# EAGLE design Boost (EAGLE 9.4.2)
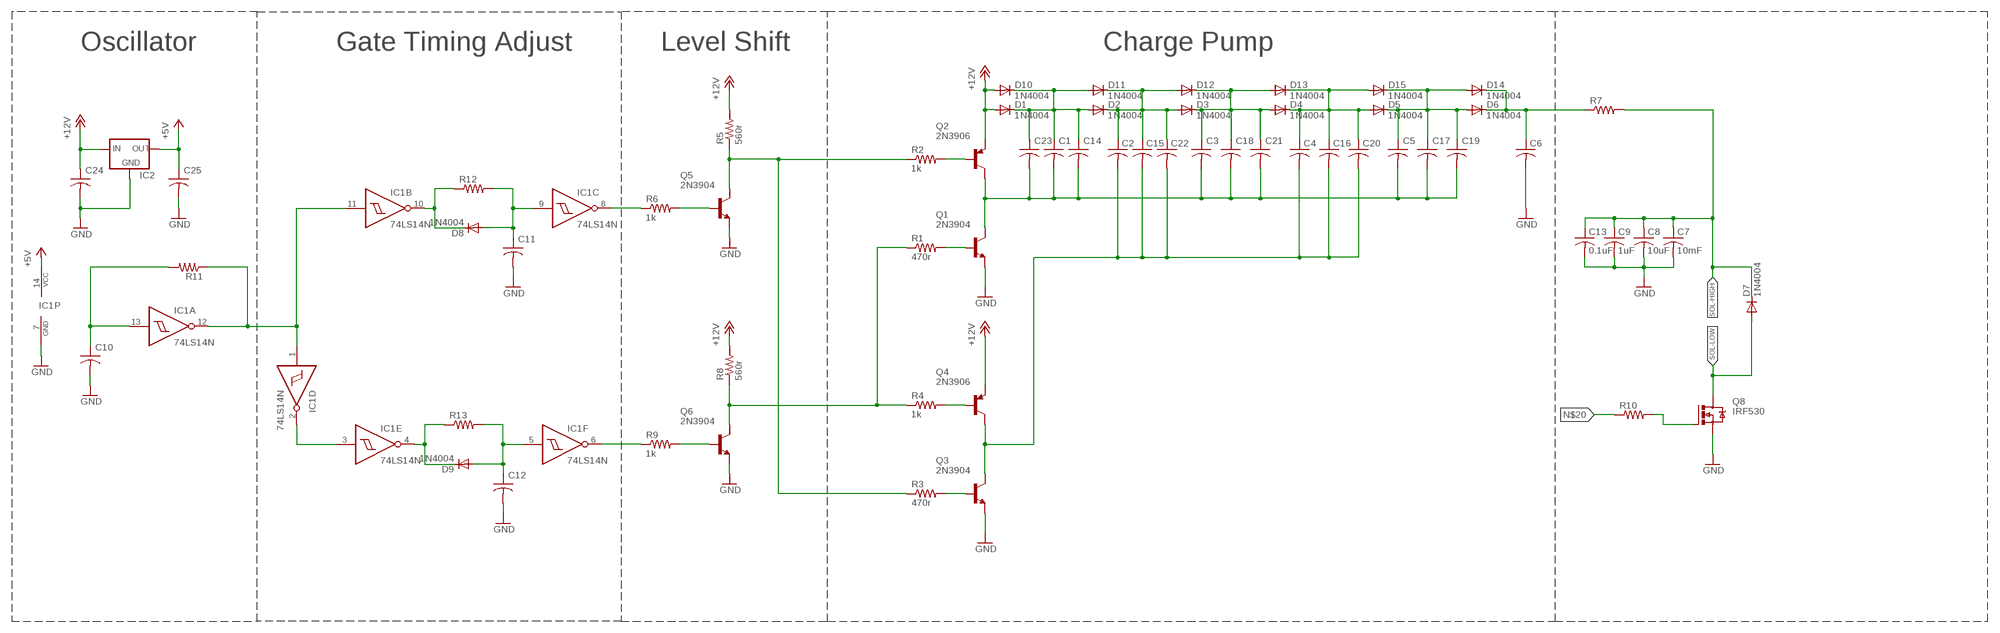
[diagram p0: schematic, sheet 1]

## Parts
C1  C-US050-024X044  [C050-024X044]
C2  C-US050-024X044  [C050-024X044]
C3  C-US050-024X044  [C050-024X044]
C4  C-US050-024X044  [C050-024X044]
C5  C-US050-024X044  [C050-024X044]
C6  C-US050-024X044  [C050-024X044]
C7  10mF  C-US050-024X044  [C050-024X044]
C8  10uF  C-US050-024X044  [C050-024X044]
C9  1uF  C-US050-024X044  [C050-024X044]
C10  C-US050-024X044  [C050-024X044]
C11  C-US050-024X044  [C050-024X044]
C12  C-US050-024X044  [C050-024X044]
C13  0.1uF  C-US050-024X044  [C050-024X044]
C14  C-US050-024X044  [C050-024X044]
C15  C-US050-024X044  [C050-024X044]
C16  C-US050-024X044  [C050-024X044]
C17  C-US050-024X044  [C050-024X044]
C18  C-US050-024X044  [C050-024X044]
C19  C-US050-024X044  [C050-024X044]
C20  C-US050-024X044  [C050-024X044]
C21  C-US050-024X044  [C050-024X044]
C22  C-US050-024X044  [C050-024X044]
C23  C-US050-024X044  [C050-024X044]
C24  C-US050-024X044  [C050-024X044]
C25  C-US050-024X044  [C050-024X044]
D1  1N4004  [DO41-10]
D2  1N4004  [DO41-10]
D3  1N4004  [DO41-10]
D4  1N4004  [DO41-10]
D5  1N4004  [DO41-10]
D6  1N4004  [DO41-10]
D7  1N4004  [DO41-10]
D8  1N4004  [DO41-10]
D9  1N4004  [DO41-10]
D10  1N4004  [DO41-10]
D11  1N4004  [DO41-10]
D12  1N4004  [DO41-10]
D13  1N4004  [DO41-10]
D14  1N4004  [DO41-10]
D15  1N4004  [DO41-10]
IC1  74LS14N  [DIL14]
IC2  78XXS  [78XXS]
Q1  2N3904  [TO92]
Q2  2N3906  [TO92]
Q3  2N3904  [TO92]
Q4  2N3906  [TO92]
Q5  2N3904  [TO92]
Q6  2N3904  [TO92]
Q8  IRF530  [TO220BV]
R1  470r  R-US_0207/10  [0207/10]
R2  1k  R-US_0207/10  [0207/10]
R3  470r  R-US_0207/10  [0207/10]
R4  1k  R-US_0207/10  [0207/10]
R5  560r  R-US_0207/10  [0207/10]
R6  1k  R-US_0207/10  [0207/10]
R7  R-US_0207/10  [0207/10]
R8  560r  R-US_0207/10  [0207/10]
R9  1k  R-US_0207/10  [0207/10]
R10  R-US_0207/10  [0207/10]
R11  R-US_0207/10  [0207/10]
R12  R-US_0207/10  [0207/10]
R13  R-US_0207/10  [0207/10]

## Nets
+5V: C25.1 IC1.14(P:VCC) IC2.OUT
+5V1: C2.1 C15.1 C22.1 D2.C D3.A D11.C D12.A
+12V: C24.1 D1.A D10.A IC2.IN Q2.3(E) Q4.3(E) R5.2 R8.2
GND: C6.2 C7.2 C8.2 C9.2 C10.2 C11.2 C12.2 C13.2 C24.2 C25.2 IC1.7(P:GND) IC2.GND Q1.3(E) Q3.3(E) Q5.3(E) Q6.3(E) Q8.S
N$1: Q5.1(C) R2.1 R3.1 R5.1
N$2: C1.1 C14.1 C23.1 D1.C D2.A D10.C D11.A
N$3: Q6.1(C) R1.1 R4.1 R8.1
N$4: Q1.2(B) R1.2
N$5: Q2.2(B) R2.2
N$6: Q5.2(B) R6.2
N$8: C3.1 C18.1 C21.1 D3.C D4.A D12.C D13.A
N$9: C4.1 C16.1 C20.1 D4.C D5.A D13.C D15.A
N$11: C5.1 C17.1 C19.1 D5.C D6.A D14.A D15.C
N$12: C6.1 D6.C D14.C R7.1
N$13: C1.2 C3.2 C5.2 C14.2 C17.2 C18.2 C19.2 C21.2 C23.2 Q1.1(C) Q2.1(C)
N$14: Q3.2(B) R3.2
N$15: Q4.2(B) R4.2
N$16: IC1.8(C:O) R6.1
N$17: Q6.2(B) R9.2
N$18: IC1.6(F:O) R9.1
N$19: Q8.G R10.2
N$20: R10.1
N$21: IC1.1(D:I) IC1.11(B:I) IC1.12(A:O) R11.1
N$22: C10.1 IC1.13(A:I) R11.2
N$23: C11.1 D8.A IC1.9(C:I) R12.2
N$24: D8.C IC1.10(B:O) R12.1
N$25: C12.1 D9.A IC1.5(F:I) R13.2
N$26: D9.C IC1.4(E:O) R13.1
N$27: IC1.2(D:O) IC1.3(E:I)
N$30: C2.2 C4.2 C15.2 C16.2 C20.2 C22.2 Q3.1(C) Q4.1(C)
SOL-HIGH: C7.1 C8.1 C9.1 C13.1 D7.C R7.2
SOL-LOW: D7.A Q8.D

## Notes on the sheet
- Oscillator | Gate Timing Adjust | Level Shift | Charge Pump

## Library data of the parts
C1-C25 = rcl:C-US: CAPACITOR, American symbol; SPICEPREFIX: C
D1-D15 = diode:1N4004: DIODE general purpose rectifier, 1 A
IC1 = 74xx-us:74*14: Hex schmitt trigger INVERTER
IC2 = v-reg:78XXS: VOLTAGE REGULATOR
Q1 Q3 Q5 Q6 = transistor-npn:2N3904: NPN Transistor
Q2 Q4 = transistor-pnp:2N3906: PNP Transistor
Q8 = transistor-power:IRF530: HEXFET Power MOSFET
R1-R13 = rcl:R-US_: RESISTOR, American symbol; SPICEPREFIX: R

## Board
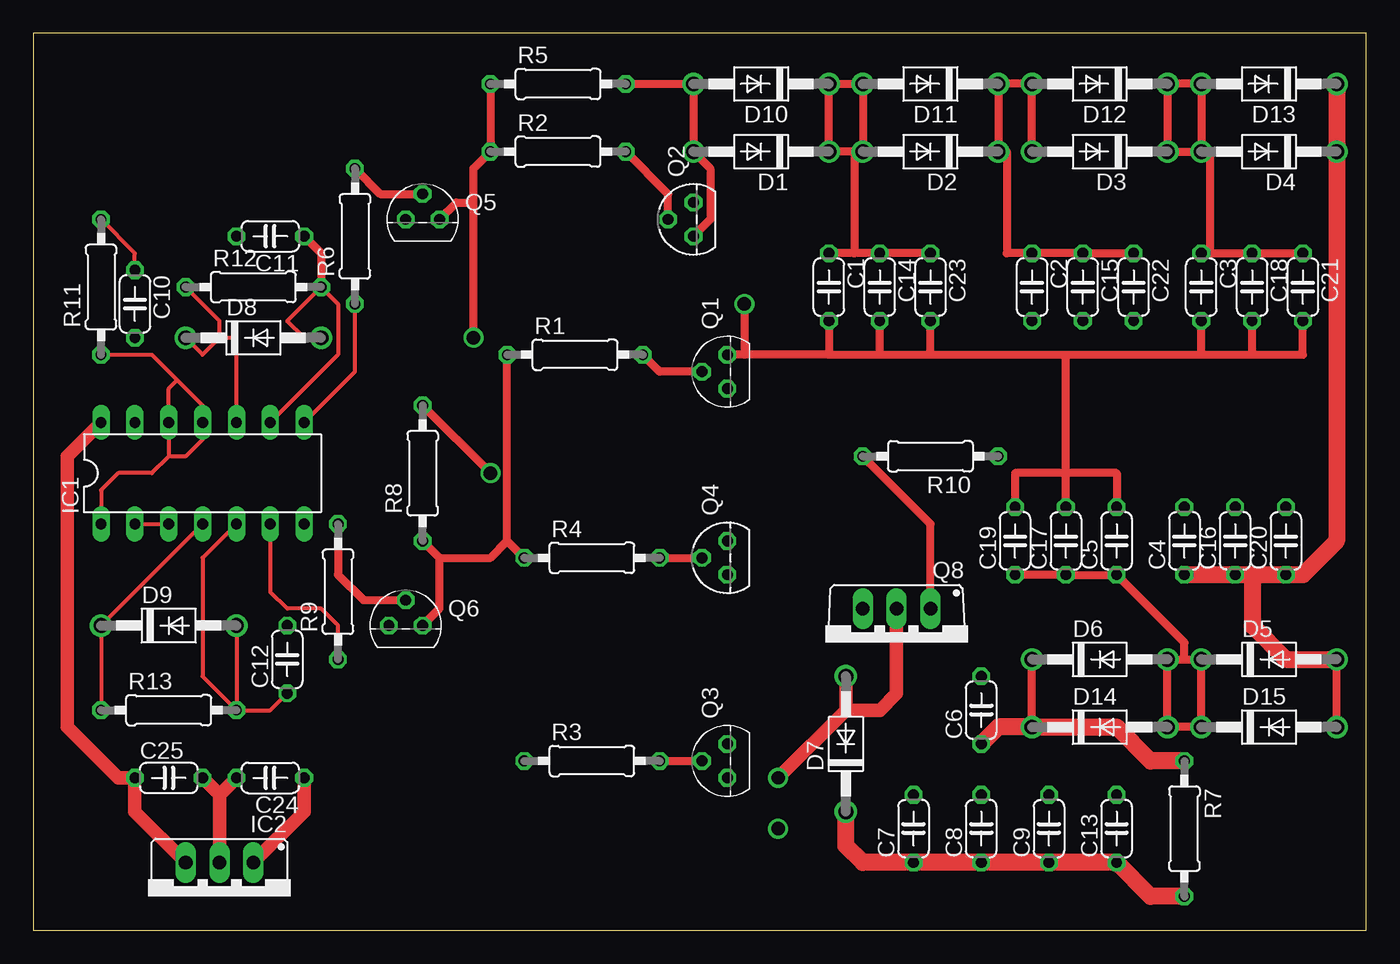
[diagram p1: board, top side]
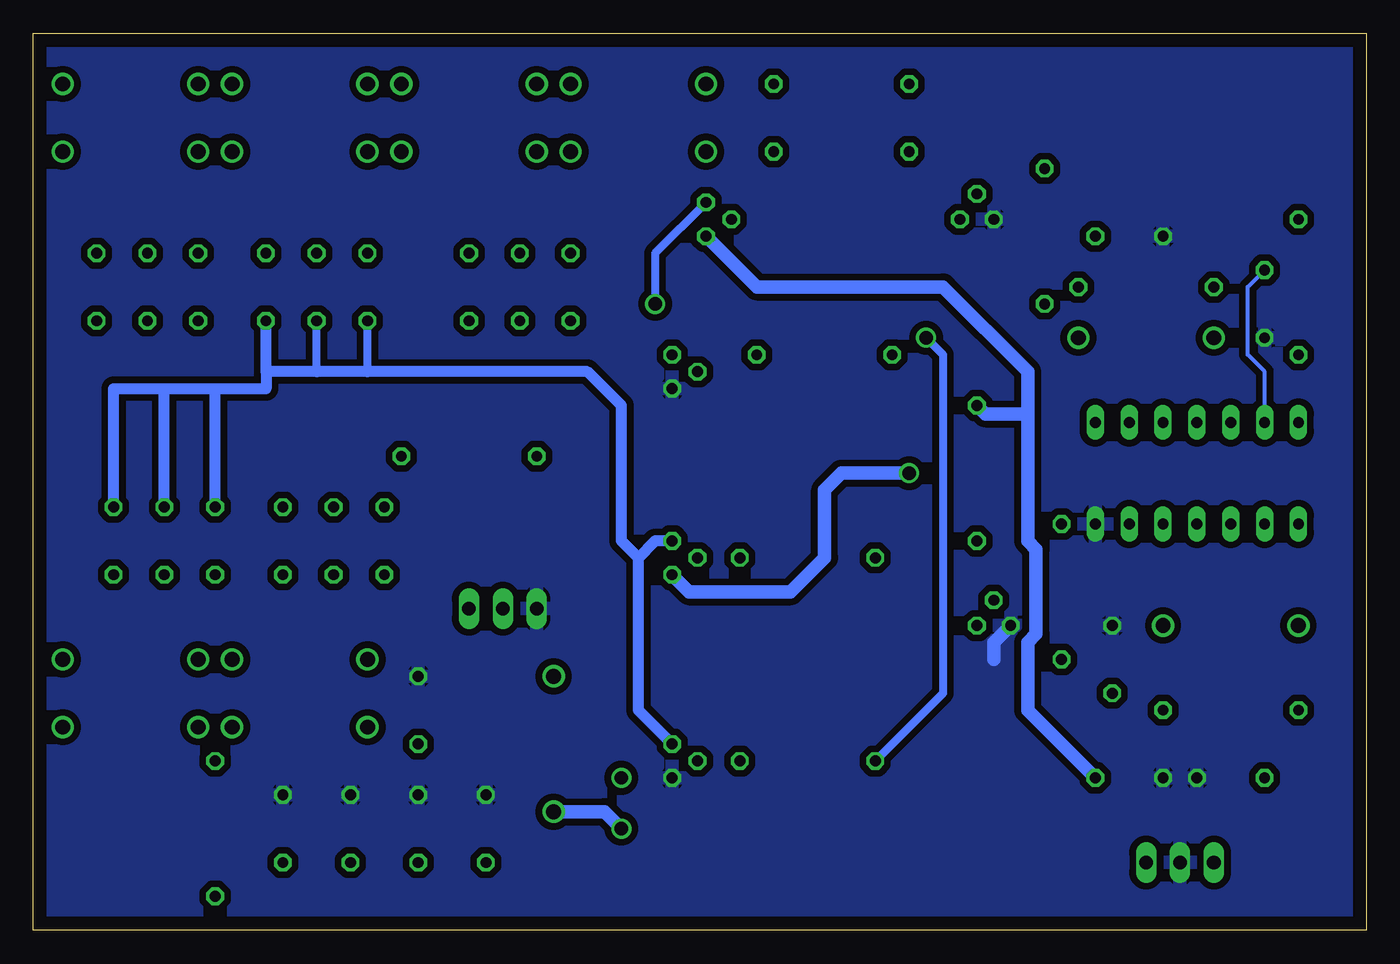
[diagram p2: board, bottom side, seen from below]

Size 100 x 67.3 mm. Coordinates in mm from the lower left corner, seen from the top.
Outline: 0,0 100,0 100,67.3 0,67.3 0,0
Copper layers (1*16): Top 0.035mm / dielectric 1.5mm / Bottom 0.035mm
Design rules "default": minimum track width 6mil, minimum drill 0.35mm, track to track 6mil, track to pad 6mil, pad to pad 6mil, via to via 6mil, smd to smd 6mil, copper to edge 40mil, drill to drill 6mil, minimum pad ring 10mil, minimum via ring 8mil, stop-mask expansion 4mil, vias tented up to drill 0mil, thermal gap 10mil

### Footprints (pad centres in the part's own frame; a part is rotated, then mirrored left to right if it is on the bottom)
C050-024X044 = drill 0.813 octagon: 1 -2.54,0; 2 2.54,0
DO41-10 = drill 1.118: A 5.08,0; C -5.08,0
DIL14 = drill 0.813 long: 1 -7.62,-3.81; 2 -5.08,-3.81; 3 -2.54,-3.81; 4 0,-3.81; 5 2.54,-3.81; 6 5.08,-3.81; 7 7.62,-3.81; 8 7.62,3.81; 9 5.08,3.81; 10 2.54,3.81; 11 0,3.81; 12 -2.54,3.81; 13 -5.08,3.81; 14 -7.62,3.81
78XXS = drill 1.016 long: GND 0,-2.54; IN -2.54,-2.54; OUT 2.54,-2.54
TO92 = drill 0.813 octagon: 1 1.27,0; 2 0,1.905; 3 -1.27,0
TO220BV = drill 1.016 long: D 0,-2.54; G -2.54,-2.54; S 2.54,-2.54
0207/10 = drill 0.813 octagon: 1 -5.08,0; 2 5.08,0

### Placement (x,y rotation side)
C1  59.69,48.26 270 top
C2  74.93,48.26 270 top
C3  87.63,48.26 270 top
C4  86.36,29.21 90 top
C5  81.28,29.21 90 top
C6  71.12,16.51 90 top
C7  66.04,7.62 90 top
C8  71.12,7.62 90 top
C9  76.2,7.62 90 top
C10  7.62,46.99 270 top
C11  17.78,52.07 180 top
C12  19.05,20.32 90 top
C13  81.28,7.62 90 top
C14  63.5,48.26 270 top
C15  78.74,48.26 270 top
C16  90.17,29.21 90 top
C17  77.47,29.21 90 top
C18  91.44,48.26 270 top
C19  73.66,29.21 90 top
C20  93.98,29.21 90 top
C21  95.25,48.26 270 top
C22  82.55,48.26 270 top
C23  67.31,48.26 270 top
C24  17.78,11.43 180 top
C25  10.16,11.43 0 top
D1  54.61,58.42 180 top
D2  67.31,58.42 180 top
D3  80.01,58.42 180 top
D4  92.71,58.42 180 top
D5  92.71,20.32 0 top
D6  80.01,20.32 0 top
D7  60.96,13.97 90 top
D8  16.51,44.45 0 top
D9  10.16,22.86 0 top
D10  54.61,63.5 180 top
D11  67.31,63.5 180 top
D12  80.01,63.5 180 top
D13  92.71,63.5 180 top
D14  80.01,15.24 0 top
D15  92.71,15.24 0 top
IC1  12.7,34.29 0 top
IC2  13.97,2.54 180 top
Q1  52.07,41.91 90 top
Q2  49.53,53.34 90 top
Q3  52.07,12.7 90 top
Q4  52.07,27.94 90 top
Q5  29.21,53.34 0 top
Q6  27.94,22.86 0 top
Q8  64.77,21.59 180 top
R1  40.64,43.18 0 top
R2  39.37,58.42 0 top
R3  41.91,12.7 0 top
R4  41.91,27.94 0 top
R5  39.37,63.5 0 top
R6  24.13,52.07 90 top
R7  86.36,7.62 270 top
R8  29.21,34.29 90 top
R9  22.86,25.4 90 top
R10  67.31,35.56 180 top
R11  5.08,48.26 90 top
R12  16.51,48.26 0 top
R13  10.16,16.51 0 top

### Tracks (layer width: path | path; a pad name or v marks a point on that pad's centre or on a via)
+5V
  Top 1.016: IC2.OUT 7.62,8.89 C25.1 6.35,11.43 2.54,15.24 2.54,35.56 IC1.14
+5V1
  Top 0.61: D3.A D12.A D11.C D2.C 73.03,58.42 73.03,50.8 C2.1 C15.1 C22.1
+12V  (via drill 1)
  Top 0.61: R5.2 D10.A D1.A 50.8,57.15 50.8,53.34 Q2.3 | v34.29,34.29 R8.2
  Top 1.016: IC2.IN 20.32,8.89 C24.1
  Bottom 1.016: Q2.3 45.72,48.26 31.75,48.26 25.4,41.91 25.4,38.73 | Q4.3 50.8,25.4 43.18,25.4 40.64,27.94 40.64,33.02 39.37,34.29 v34.29,34.29 | R8.2 28.57,38.73 25.4,38.73 | 25.4,38.73 25.4,29.21 24.77,28.57 24.77,22.23 25.4,21.59 25.4,16.51 C24.1
GND
  Top 1.016: IC2.GND 13.97,10.16 | 13.97,10.16 C24.2 | C25.2 13.97,10.16
  Bottom 1.016: Q6.3 27.94,21.59 27.94,20.32
  pour Bottom (isolate 0.508): -62.23,83.82 217.17,83.82 217.17,-31.75 -62.23,-31.75
N$1  (via drill 1)
  Top 0.61: R5.1 R2.1 33.02,57.15 33.02,54.61 | v33.02,44.45 33.02,54.61 | Q5.1 31.75,54.61 33.02,54.61
  Bottom 0.61: R3.1 31.75,17.78 31.75,43.18 v33.02,44.45
N$2
  Top 0.61: D2.A D11.A D10.C D1.C 61.59,58.42 61.59,50.8 C14.1 | C23.1 C14.1 | C14.1 C1.1
N$3
  Top 0.61: R8.1 30.48,27.94 | Q6.1 30.48,24.13 30.48,27.94 | R4.1 35.56,29.21 | 35.56,29.21 R1.1 | 30.48,27.94 34.29,27.94 35.56,29.21
N$4
  Top 0.61: Q1.2 46.99,41.91 R1.2
N$5
  Top 0.61: Q2.2 47.62,55.24 R2.2
N$6
  Top 0.61: R6.2 26.04,55.24 Q5.2
N$8
  Top 0.61: D4.A D13.A D12.C D3.C D4.A | C3.1 88.27,50.8 | 88.27,50.8 C18.1 C21.1 | 88.27,50.8 88.27,58.42 D4.A
N$9
  Top 0.61: D15.A D5.A | C20.1 91.44,26.67 C16.1
  Top 1.27: D13.C D4.C 97.79,29.21 95.25,26.67 C20.1 C16.1 C4.1 | 91.44,26.67 91.44,22.86 93.98,20.32 D5.A
N$11
  Top 0.61: 86.36,20.32 D6.A D14.A D15.C D5.C 86.36,20.32 | C19.1 C17.1 C5.1 86.36,21.59 86.36,20.32
N$12
  Top 0.61: D14.C D6.C
  Top 1.27: C6.1 72.39,15.24 D14.C 81.28,15.24 83.82,12.7 R7.1
N$13  (via drill 1)
  Top 0.61: 59.69,43.18 53.34,43.18 | 53.34,43.18 Q1.1 | C1.2 59.69,43.18 | 59.69,43.18 63.5,43.18 | 63.5,43.18 C14.2 | 63.5,43.18 67.31,43.18 | 67.31,43.18 C23.2 | 67.31,43.18 77.47,43.18 | 77.47,43.18 87.63,43.18 | 87.63,43.18 C3.2 | 87.63,43.18 91.44,43.18 | 91.44,43.18 C18.2 | C5.2 81.28,34.29 77.47,34.29 | C17.2 77.47,34.29 | 77.47,34.29 73.66,34.29 C19.2 | v53.34,46.99 53.34,43.18 | 77.47,34.29 77.47,43.18 | 91.44,43.18 95.25,43.18 C21.2
  Bottom 0.61: Q2.1 53.34,50.8 v53.34,46.99
N$14
  Top 0.61: R3.2 Q3.2
N$15
  Top 0.61: R4.2 Q4.2
N$16
  Top 0.305: IC1.8 24.13,41.91 R6.1
N$17
  Top 0.61: R9.2 22.86,26.67 24.77,24.77 Q6.2
N$18
  Top 0.305: IC1.6 17.78,25.4 19.05,24.13 21.59,24.13 22.86,22.86 R9.1
N$19
  Top 0.61: Q8.G 67.31,30.48 R10.2
N$21
  Top 0.305: IC1.1 5.08,33.02 6.35,34.29 8.89,34.29 10.16,35.56 | 10.16,35.56 11.43,35.56 12.7,36.83 IC1.11 12.7,39.37 10.79,41.27 | R11.1 8.89,43.18 10.79,41.27 | 10.79,41.27 10.16,40.64 IC1.12 10.16,35.56
N$22
  Top 0.305: C10.1 7.62,50.8 R11.2
  Bottom 0.305: IC1.13 7.62,41.91 8.89,43.18 8.89,48.26 C10.1
N$23
  Top 0.305: IC1.9 22.86,43.18 22.86,46.99 R12.2 19.05,45.72 20.32,44.45 D8.A
  Top 0.61: C11.1 21.59,50.8 R12.2
N$24
  Top 0.305: IC1.10 15.24,44.45 D8.C 12.7,43.18 13.97,44.45 13.97,45.72 R12.1
N$25
  Top 0.305: R13.2 D9.A 12.7,22.86 | R13.2 17.78,16.51 C12.1 | IC1.5 12.7,27.94 12.7,22.86 | 12.7,22.86 12.7,19.05 R13.2
N$26
  Top 0.305: IC1.4 D9.C R13.1
N$27
  Top 0.305: IC1.2 IC1.3
N$30
  Bottom 0.61: 93.98,40.64 90.17,40.64 86.36,40.64 82.55,40.64 | 78.74,41.91 C15.2 | 74.93,41.91 C2.2
  Bottom 0.813: Q3.1 54.61,16.51 54.61,27.94 | 54.61,27.94 53.34,29.21 Q4.1 | 54.61,27.94 55.88,29.21 55.88,39.37 58.42,41.91 74.93,41.91 78.74,41.91 82.55,41.91 | 82.55,41.91 C22.2 | 82.55,41.91 82.55,40.64 93.98,40.64 C20.2 | C4.2 86.36,40.64 | C16.2 90.17,40.64
SOL-HIGH  (via drill 1)
  Top 1.27: R7.2 83.82,2.54 C13.1 C9.1 C8.1 C7.1 62.23,5.08 60.96,6.35 D7.C
  Bottom 1.016: D7.C 57.15,8.89 v55.88,7.62
SOL-LOW  (via drill 1)
  Top 1.016: D7.A 60.96,16.51 | 60.96,16.51 v55.88,11.43 | 60.96,16.51 63.5,16.51 64.77,17.78 Q8.D